# Altium project ISL6236A_DEMO_V1.PrjPcb
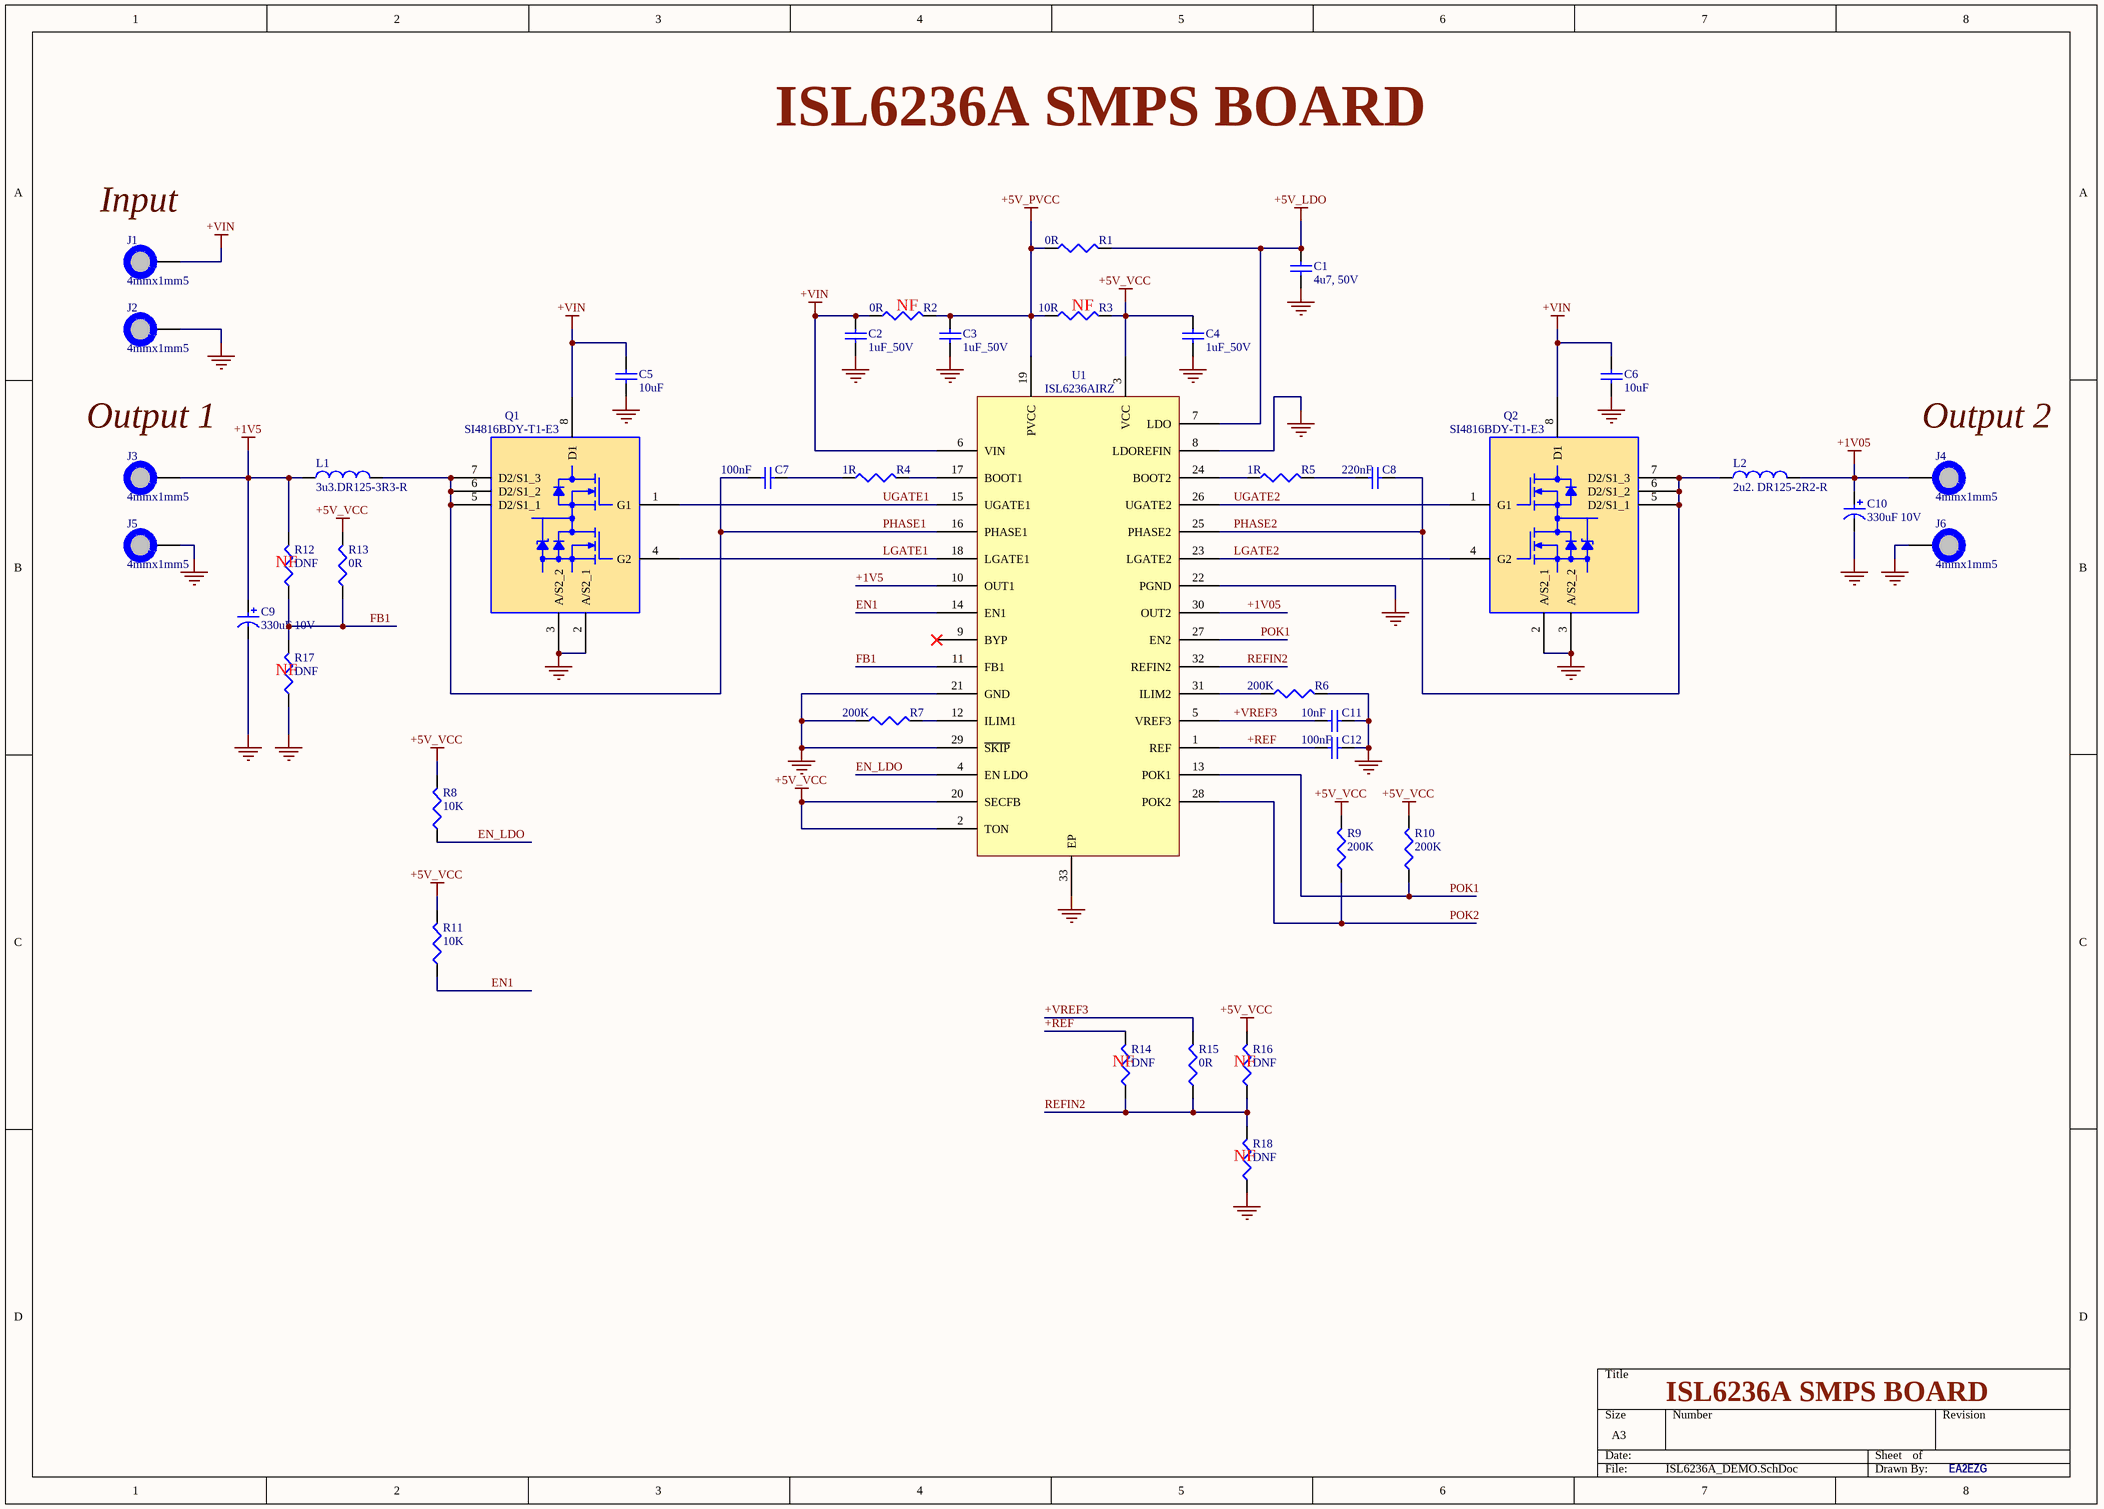
[diagram p0: ISL6236A_DEMO.SchDoc]
1 sheet, 41 parts. Net scope: global (net labels, ports and power ports of the same name join across sheets).
Board file: ISL6236_DEMO_PCB.PcbDoc

## Sheet ISL6236A_DEMO.SchDoc
size A3; SheetNumber: 1; SheetTotal: 1

### Parts
C1  4u7, 50V  [C1206]
C2  1uF_50V  [C0805]
C3  1uF_50V  [C0805]
C4  1uF_50V  [C0805]
C5  10uF  [C1210]
C6  10uF  [C1210]
C7  100nF  [C0805]
C8  220nF  [C0805]
C9  330uF 10V  [7343-43]
C10  330uF 10V  [7343-43]
C11  10nF  [C0805]
C12  100nF  [C0805]
J1  4mmx1mm5  [PAD_WITH_HOLE_4mmx1mm5]
J2  4mmx1mm5  [PAD_WITH_HOLE_4mmx1mm5]
J3  4mmx1mm5  [PAD_WITH_HOLE_4mmx1mm5]
J4  4mmx1mm5  [PAD_WITH_HOLE_4mmx1mm5]
J5  4mmx1mm5  [PAD_WITH_HOLE_4mmx1mm5]
J6  4mmx1mm5  [PAD_WITH_HOLE_4mmx1mm5]
L1  3u3.DR125-3R3-R  [DR125]
L2  2u2. DR125-2R2-R  [DR125]
Q1  SI4816BDY-T1-E3  [SO-8]
Q2  SI4816BDY-T1-E3  [SO-8]
R1  0R  [R0805]
R2  0R  [R0805]
R3  10R  [R0805]
R4  1R  [R0805]
R5  1R  [R0805]
R6  200K  [R0805]
R7  200K  [R0805]
R8  10K  [R0805]
R9  200K  [R0805]
R10  200K  [R0805]
R11  10K  [R0805]
R12  DNF  [R0805]
R13  0R  [R0805]
R14  DNF  [R0805]
R15  0R  [R0805]
R16  DNF  [R0805]
R17  DNF  [R0805]
R18  DNF  [R0805]
U1  ISL6236AIRZ  [L32.5X5B]

### Nets
+1V5: C9.1 J3.1 L1.1 R12.2 U1.10(OUT1)
+1V05: C10.1 J4.1 L2.2 U1.30(OUT2)
+5V_LDO: C1.2 R1.2 U1.7(LDO)
+5V_PVCC: C3.2 R1.1 R2.2 R3.1 U1.19(PVCC)
+5V_VCC: C4.2 R3.2 R8.2 R9.2 R10.2 R11.2 R13.2 R16.2 U1.2(TON) U1.3(VCC) U1.20(SECFB)
+VIN: C2.2 C5.2 C6.2 J1.1 Q1.8(D1) Q2.8(D1) R2.1 U1.6(VIN)
GND: C1.1 C2.1 C3.1 C4.1 C5.1 C6.1 C9.2 C10.2 C11.1 C12.2 J2.1 J5.1 J6.1 Q1.2(A/S2_1) Q1.3(A/S2_2) Q2.2(A/S2_1) Q2.3(A/S2_2) R6.2 R7.1 R17.1 R18.1 U1.8(LDOREFIN) U1.21(GND) U1.22(PGND) U1.29(~{SKIP}) U1.33(EP)
+REF: C12.1 R14.2 U1.1(REF)
+VREF3: C11.2 R15.2 U1.5(VREF3)
EN1: R11.1 U1.14(EN1)
EN_LDO: R8.1 U1.4(EN_LDO)
FB1: R12.1 R13.1 R17.2 U1.11(FB1)
LGATE1: Q1.4(G2) U1.18(LGATE1)
LGATE2: Q2.4(G2) U1.23(LGATE2)
PHASE1: C7.1 L1.2 Q1.5(D2/S1_1) Q1.6(D2/S1_2) Q1.7(D2/S1_3) U1.16(PHASE1)
PHASE2: C8.2 L2.1 Q2.5(D2/S1_1) Q2.6(D2/S1_2) Q2.7(D2/S1_3) U1.25(PHASE2)
POK1: R10.1 U1.13(POK1) U1.27(EN2)
POK2: R9.1 U1.28(POK2)
REFIN2: R14.1 R15.1 R16.1 R18.2 U1.32(REFIN2)
UGATE1: Q1.1(G1) U1.15(UGATE1)
UGATE2: Q2.1(G1) U1.26(UGATE2)
NetC7_2: C7.2 R4.1
NetC8_1: C8.1 R5.2
NetR4_2: R4.2 U1.17(BOOT1)
NetR5_1: R5.1 U1.24(BOOT2)
NetR6_1: R6.1 U1.31(ILIM2)
NetR7_2: R7.2 U1.12(ILIM1)

Not connected (* = marked no-connect by the designer): U1 9(BYP)*

### Notes on the sheet
- ISL6236A SMPS BOARD
- (near J1) Input
- (near R2) NF
- (near R3) NF
- (near J3) Output 1
- (near J4) Output 2
- (near R12) NF
- (near R17) NF
- (near R14) NF
- (near R16) NF
- (near R18) NF
- EA2EZG

### Library data of the parts
C1 = C3216X5R1H475K160AB: C Series 1206 4.7 uF 50 V ±10 % Tolerance X5R SMT Multilayer Ceramic Capacitor; Manufacturer: TDK; Supplier 1: Digi-Key; Manufacturer Part Number: C3216X5R1H475K160AB; RoHS: Yes; Category: Ceramic Capacitors; Stock 1: 67002; Pricing 1: 1=0,72, 10=0,53, 50=0,4242, 100=0,3636, 500=0,28784, 1000=0,2424 (USD); ComponentLink1URL: https://datasheet.ciiva.com/24216/c3216x5r1h475k160ab-265269-24216325.pdf?src-supplier=Mouser; ComponentLink1Description: https://datasheet.ciiva.com/24216/c3216x5r1h475k160ab-265269-24216325.pdf?src-supplier=Mouser; ComponentLink2URL: https://datasheet.ciiva.com/6286/tdkmlcccaprange-6286230.pdf?src-supplier=Digi-Key; ComponentLink2Description: https://datasheet.ciiva.com/6286/tdkmlcccaprange-6286230.pdf?src-supplier=Digi-Key; ComponentLink3URL: https://datasheet.ciiva.com/6286/tdkmlcccaprange-6286233.pdf?src-supplier=Digi-Key; ComponentLink3Description: https://datasheet.ciiva.com/6286/tdkmlcccaprange-6286233.pdf?src-supplier=Digi-Key; ComponentLink4URL: https://datasheet.ciiva.com/6286/tdkmlcccaprange-6286236.pdf?src-supplier=Digi-Key; ComponentLink4Description: https://datasheet.ciiva.com/6286/tdkmlcccaprange-6286236.pdf?src-supplier=Digi-Key; Supplier Part Number 1: 445-5994-1-ND
C2-C4 = C2012X7R1H105K125AB: C Series 0805 1 uF 50 V ±10% Tolerance X7R SMT Multilayer Ceramic Capacitor; Manufacturer: TDK; Supplier 1: Digi-Key; Manufacturer Part Number: C2012X7R1H105K125AB; RoHS: Yes; Category: Ceramic Capacitors; Stock 1: 331733; Pricing 1: 1=0,28, 10=0,189, 50=0,126, 100=0,1071, 500=0,07562, 1000=0,06618 (USD); ComponentLink1URL: https://datasheet.ciiva.com/6274/tdkmlcccaprange-6274886.pdf?src-supplier=Digi-Key; ComponentLink1Description: https://datasheet.ciiva.com/6274/tdkmlcccaprange-6274886.pdf?src-supplier=Digi-Key; ComponentLink2URL: https://datasheet.ciiva.com/6274/tdkmlcccaprange-6274888.pdf?src-supplier=Digi-Key; ComponentLink2Description: https://datasheet.ciiva.com/6274/tdkmlcccaprange-6274888.pdf?src-supplier=Digi-Key; ComponentLink3URL: https://datasheet.ciiva.com/6274/tdkmlcccaprange-6274890.pdf?src-supplier=Digi-Key; ComponentLink3Description: https://datasheet.ciiva.com/6274/tdkmlcccaprange-6274890.pdf?src-supplier=Digi-Key; ComponentLink4URL: https://datasheet.ciiva.com/24191/general-b11-24191449.pdf?src-supplier=Future+Electronics; ComponentLink4Description: https://datasheet.ciiva.com/24191/general-b11-24191449.pdf?src-supplier=Future+Electronics; ComponentLink5URL: https://datasheet.ciiva.com/28673/mlcc-commercial-general-en-28673565.pdf?src-supplier=Element14; ComponentLink5Description: https://datasheet.ciiva.com/28673/mlcc-commercial-general-en-28673565.pdf?src-supplier=Element14; ComponentLink6URL: https://datasheet.ciiva.com/22718/1796654-22718037.pdf?src-supplier=Element14; ComponentLink6Description: https://datasheet.ciiva.com/22718/1796654-22718037.pdf?src-supplier=Element14; ComponentLink7URL: https://datasheet.ciiva.com/23803/1796654-23803036.pdf?src-supplier=Newark; ComponentLink7Description: https://datasheet.ciiva.com/23803/1796654-23803036.pdf?src-supplier=Newark; Supplier Part Number 1: 445-7547-1-ND
C5 C6 = C1210C106K5PACTU: Multilayer Ceramic Capacitor, 10 uF, 50 V, ± 10%, X5R, 1210 [3225 Metric]; Manufacturer: KEMET; Supplier 1: Digi-Key; Manufacturer Part Number: C1210C106K5PACTU; RoHS: Yes; Category: Ceramic Capacitors; Stock 1: 93202; Pricing 1: 1=0,95, 10=0,722, 50=0,6, 100=0,5166, 500=0,39996 (USD); ComponentLink1URL: https://datasheet.ciiva.com/29540/kem-c1006-x5r-smd-29540231.pdf?src-supplier=Digi-Key; ComponentLink1Description: https://datasheet.ciiva.com/29540/kem-c1006-x5r-smd-29540231.pdf?src-supplier=Digi-Key; ComponentLink2URL: https://datasheet.ciiva.com/29540/kem-c1006-x5r-smd-29540232.pdf?src-supplier=Digi-Key; ComponentLink2Description: https://datasheet.ciiva.com/29540/kem-c1006-x5r-smd-29540232.pdf?src-supplier=Digi-Key; ComponentLink3URL: https://datasheet.ciiva.com/29540/kem-c1006-x5r-smd-29540233.pdf?src-supplier=Digi-Key; ComponentLink3Description: https://datasheet.ciiva.com/29540/kem-c1006-x5r-smd-29540233.pdf?src-supplier=Digi-Key; Supplier Part Number 1: 399-C1210C106K5PAC7800CT-ND
C7 C12 = C0805C104K5REC7210: Cap Cer 0805 0.1UF 50V X7R 10%; Manufacturer: KEMET; Supplier 1: Digi-Key; Manufacturer Part Number: C0805C104K5REC7210; RoHS: Yes; Category: Ceramic Capacitors; Stock 1: 14120; Pricing 1: 1=0,26, 10=0,176, 50=0,1054, 100=0,089, 500=0,06092, 1000=0,05389, 2500=0,05155, 5000=0,04686 (USD); RoHS Compliant: Yes; ComponentLink1URL: https://api.kemet.com/component-edge/download/datasheet/C0805C104K5REC7210.pdf?src-supplier=Digi-Key; ComponentLink1Description: https://api.kemet.com/component-edge/download/datasheet/C0805C104K5REC7210.pdf?src-supplier=Digi-Key; Supplier Part Number 1: 399-C0805C104K5REC7210CT-ND
C8 = C0805F224K5RACTU: Cap Ceramic 0.22uF 50V X7R 10% SMD 2.0 x 1.2 mm OMD-CAP 125 C Plastic T/R; Manufacturer: KEMET; Supplier 1: Digi-Key; Manufacturer Part Number: C0805F224K5RACTU; RoHS: Yes; Category: Ceramic Capacitors; Stock 1: 27532; Pricing 1: 1=0,45, 10=0,319, 50=0,241, 100=0,21, 500=0,15554, 1000=0,13221 (USD); ComponentLink1URL: https://datasheet.ciiva.com/147/docfinderpartnumber-c0805f224k5ractu-147508.pdf?src-supplier=Digi-Key; ComponentLink1Description: https://datasheet.ciiva.com/147/docfinderpartnumber-c0805f224k5ractu-147508.pdf?src-supplier=Digi-Key; ComponentLink2URL: https://datasheet.ciiva.com/5969/kem-c1002-x7r-smd-5969831.pdf?src-supplier=Farnell; ComponentLink2Description: https://datasheet.ciiva.com/5969/kem-c1002-x7r-smd-5969831.pdf?src-supplier=Farnell; ComponentLink3URL: https://datasheet.ciiva.com/7842/kem-c1002-x7r-smd-7842633.pdf?src-supplier=Element14; ComponentLink3Description: https://datasheet.ciiva.com/7842/kem-c1002-x7r-smd-7842633.pdf?src-supplier=Element14; Supplier Part Number 1: 399-C0805F224K5RAC7800CT-ND
C9 C10 = T530X337M010ATE004: Cap Tant Solid 330uF 10V X CASE 20% (7.3 X 4.3 X 4mm) SMD 7343-43 0.004 Ohm 125 C T/R; Manufacturer: KEMET; Supplier 1: Digi-Key; Manufacturer Part Number: T530X337M010ATE004; RoHS: Yes; Category: Polymer Capacitors; Stock 1: 1921; Pricing 1: 1=7,14, 10=6,35, 50=5,5562, 100=5,0799 (USD); ComponentLink1URL: https://datasheet.ciiva.com/11794/0900766b80deaa91-11794477.pdf?src-supplier=Rs; ComponentLink1Description: https://datasheet.ciiva.com/11794/0900766b80deaa91-11794477.pdf?src-supplier=Rs; ComponentLink2URL: https://datasheet.ciiva.com/14593/70096008-14593753.pdf?src-supplier=Allied+Electronics; ComponentLink2Description: https://datasheet.ciiva.com/14593/70096008-14593753.pdf?src-supplier=Allied+Electronics; Supplier Part Number 1: 399-10378-1-ND
C11 = C0805F103K5RACTU: 0805 C 10nF Ceramic Multilayer Capacitor; 50 VDC; +125degC; X7R Dielec; +/-10%; Manufacturer: KEMET; Supplier 1: Digi-Key; Manufacturer Part Number: C0805F103K5RACTU; RoHS: Yes; Category: Ceramic Capacitors; Stock 1: 11337; Pricing 1: 1=0,35, 10=0,237, 50=0,158, 100=0,1343, 500=0,09478, 1000=0,08293 (USD); ComponentLink1URL: https://datasheet.ciiva.com/146/docfinderpartnumber-c0805f103k5ractu-146278.pdf?src-supplier=Digi-Key; ComponentLink1Description: https://datasheet.ciiva.com/146/docfinderpartnumber-c0805f103k5ractu-146278.pdf?src-supplier=Digi-Key; ComponentLink2URL: https://datasheet.ciiva.com/7842/48829-7842407.pdf?src-supplier=Element14; ComponentLink2Description: https://datasheet.ciiva.com/7842/48829-7842407.pdf?src-supplier=Element14; ComponentLink3URL: https://datasheet.ciiva.com/7842/48829-7842408.pdf?src-supplier=Element14; ComponentLink3Description: https://datasheet.ciiva.com/7842/48829-7842408.pdf?src-supplier=Element14; Supplier Part Number 1: 399-C0805F103K5RAC7800CT-ND
J1-J6 = PAD_WITH_HOLE_4mmx1mm5: Pad with a hole 4mmx1mm5
L1 = DR125-3R3-R: Inductor Power Shielded Drum Core 3.3uH 20% 100KHz Ferrite 9.26A 6.3mOhm DCR T/R; Manufacturer: Eaton Cooper; Supplier 1: Digi-Key; Manufacturer Part Number: DR125-3R3-R; RoHS: Yes; Category: Fixed Inductors; Stock 1: 28814; Pricing 1: 1=1,24, 10=1,149, 25=1,0604, 50=0,8836, 100=0,8307, 250=0,74228 (USD); ComponentLink1URL: https://datasheet.ciiva.com/26858/getdatasheetpartid-251124-26858392.pdf?src-supplier=Verical; ComponentLink1Description: https://datasheet.ciiva.com/26858/getdatasheetpartid-251124-26858392.pdf?src-supplier=Verical; ComponentLink2URL: https://datasheet.ciiva.com/16295/bus-elx-ds-4315-dr-series-16295562.pdf?src-supplier=Future+Electronics; ComponentLink2Description: https://datasheet.ciiva.com/16295/bus-elx-ds-4315-dr-series-16295562.pdf?src-supplier=Future+Electronics; ComponentLink3URL: https://datasheet.ciiva.com/30081/4a32919a-7470-4ae0-be45-b59e3a1351ef-30081146.pdf?src-supplier=Onlinecomponents.com; ComponentLink3Description: https://datasheet.ciiva.com/30081/4a32919a-7470-4ae0-be45-b59e3a1351ef-30081146.pdf?src-supplier=Onlinecomponents.com; ComponentLink4URL: https://datasheet.ciiva.com/5707/87246-5707962.pdf?src-supplier=Farnell; ComponentLink4Description: https://datasheet.ciiva.com/5707/87246-5707962.pdf?src-supplier=Farnell; Supplier Part Number 1: 513-1529-1-ND
L2 = DR125-2R2-R: Ind Power Shielded Wirewound 2.2uH 20% 100KHz Ferrite 10.9A T/R; Manufacturer: Eaton Cooper; Supplier 1: Digi-Key; Manufacturer Part Number: DR125-2R2-R; RoHS: Yes; Category: Fixed Inductors; Stock 1: 2367; Pricing 1: 1=1,24, 10=1,149, 25=1,0604, 50=0,8838, 100=0,8307, 250=0,74236 (USD); ComponentLink1URL: https://datasheet.ciiva.com/14667/0900766b8116a153-14667792.pdf?src-supplier=Rs; ComponentLink1Description: https://datasheet.ciiva.com/14667/0900766b8116a153-14667792.pdf?src-supplier=Rs; ComponentLink2URL: https://datasheet.ciiva.com/26926/getdatasheetpartid-571249-26926912.pdf?src-supplier=Verical; ComponentLink2Description: https://datasheet.ciiva.com/26926/getdatasheetpartid-571249-26926912.pdf?src-supplier=Verical; ComponentLink3URL: https://datasheet.ciiva.com/8004/87246-8004874.pdf?src-supplier=Element14; ComponentLink3Description: https://datasheet.ciiva.com/8004/87246-8004874.pdf?src-supplier=Element14; Supplier Part Number 1: 513-1662-1-ND
Q1 Q2 = SI4816BDY-T1-E3: Trans Mosfet N-ch 30V 5.8A/8.2A 8-PIN SOIC N T/r; Manufacturer: Vishay Siliconix; Supplier 1: Digi-Key; Manufacturer Part Number: SI4816BDY-T1-E3; RoHS: Yes; Category: MOSFETs; Pricing 1: 1=1,64, 10=1,475, 100=1,1853, 500=0,97388, 1000=0,80692 (USD); ComponentLink1URL: https://datasheet.ciiva.com/15137/getdatasheetpartid-99188-15137841.pdf?src-supplier=Verical; ComponentLink1Description: https://datasheet.ciiva.com/15137/getdatasheetpartid-99188-15137841.pdf?src-supplier=Verical; ComponentLink2URL: https://datasheet.ciiva.com/7710/si4816bd-7710449.pdf?src-supplier=Element14; ComponentLink2Description: https://datasheet.ciiva.com/7710/si4816bd-7710449.pdf?src-supplier=Element14; ComponentLink3URL: https://datasheet.ciiva.com/928/si4816bd-928458.pdf?src-supplier=Digi-Key; ComponentLink3Description: https://datasheet.ciiva.com/928/si4816bd-928458.pdf?src-supplier=Digi-Key; ComponentLink4URL: https://datasheet.ciiva.com/928/si4816bd-928459.pdf?src-supplier=Digi-Key; ComponentLink4Description: https://datasheet.ciiva.com/928/si4816bd-928459.pdf?src-supplier=Digi-Key; ComponentLink5URL: https://datasheet.ciiva.com/928/si4816bd-928460.pdf?src-supplier=Digi-Key; ComponentLink5Description: https://datasheet.ciiva.com/928/si4816bd-928460.pdf?src-supplier=Digi-Key; ComponentLink6URL: https://datasheet.ciiva.com/11161/si4816bd-11161496.pdf?src-supplier=Avnet; ComponentLink6Description: https://datasheet.ciiva.com/11161/si4816bd-11161496.pdf?src-supplier=Avnet; ComponentLink7URL: https://datasheet.ciiva.com/16486/si4816bd-16486349.pdf?src-supplier=Future+Electronics; ComponentLink7Description: https://datasheet.ciiva.com/16486/si4816bd-16486349.pdf?src-supplier=Future+Electronics; ComponentLink8URL: https://datasheet.ciiva.com/18448/70026226-18448822.pdf?src-supplier=Allied+Electronics; ComponentLink8Description: https://datasheet.ciiva.com/18448/70026226-18448822.pdf?src-supplier=Allied+Electronics; Supplier Part Number 1: SI4816BDY-T1-E3DKR-ND
R1 R2 R13 R15 = RK73Z2ARTTD: Res Thick Film 0805 0 Ohm Sulfur Resistant Pad SMD Automotive T/R; Manufacturer: KOA Speer; Supplier 1: Digi-Key; Manufacturer Part Number: RK73Z2ARTTD; Category: Chip SMD Resistors; Stock 1: 238043; Pricing 1: 1=0,16, 10=0,133, 50=0,0702, 100=0,0521, 500=0,03152, 1000=0,02182 (USD); Case/Package: 0805; Min Operating Temperature: -55°C; Max Operating Temperature: 155°C; Resistance: 0R; Construction: Rectangular; Length: 2mm; Depth: 1.25mm; Military Standard: Not; RoHS Compliant: Yes; ComponentLink1URL: https://datasheet.octopart.com/RK73Z2ARTTD-KOA-Speer-datasheet-149653817.pdf?src-supplier=Farnell; ComponentLink1Description: https://datasheet.octopart.com/RK73Z2ARTTD-KOA-Speer-datasheet-149653817.pdf?src-supplier=Farnell; ComponentLink2URL: https://datasheet.octopart.com/RK73Z2ARTTD-KOA-Speer-datasheet-149653814.pdf?src-supplier=Farnell; ComponentLink2Description: https://datasheet.octopart.com/RK73Z2ARTTD-KOA-Speer-datasheet-149653814.pdf?src-supplier=Farnell; Supplier Part Number 1: 2019-RK73Z2ARTTDCT-ND
R3 = AC0805FR-0710RL: Res Thick Film 0805 10 Ohm 1% 0.125W(1/8W) ±200ppm/C Pad SMD Automotive T/R; Manufacturer: Yageo; Supplier 1: Digi-Key; Manufacturer Part Number: AC0805FR-0710RL; RoHS: Yes; Category: Chip SMD Resistors; Stock 1: 256849; Pricing 1: 1=0,1, 10=0,049, 50=0,032, 100=0,0272, 500=0,01914, 1000=0,01668 (USD); ComponentLink1URL: http://www.mouser.com/ds/2/447/yageodocoutput-1111992.pdf?src-supplier=Mouser; ComponentLink1Description: http://www.mouser.com/ds/2/447/yageodocoutput-1111992.pdf?src-supplier=Mouser; ComponentLink2URL: http://www.yageo.com/NewPortal/yageodocoutput?fileName=/pdf/R-Chip/PYu-AC_51_RoHS_L_6.pdf&src-supplier=Digi-Key; ComponentLink2Description: http://www.yageo.com/NewPortal/yageodocoutput?fileName=/pdf/R-Chip/PYu-AC_51_RoHS_L_6.pdf&src-supplier=Digi-Key; ComponentLink3URL: https://www.yageo.com/upload/media/product/productsearch/datasheet/rchip/PYu-AC_51_RoHS_L_7.pdf?src-supplier=Digi-Key; ComponentLink3Description: https://www.yageo.com/upload/media/product/productsearch/datasheet/rchip/PYu-AC_51_RoHS_L_7.pdf?src-supplier=Digi-Key; Supplier Part Number 1: YAG3690CT-ND
R4 R5 = AC0805FR-071RL: Res Thick Film 0805 1 Ohm 1% 0.125W(1/8W) ±200ppm/C Pad SMD Automotive T/R; Manufacturer: Yageo; Supplier 1: Digi-Key; Manufacturer Part Number: AC0805FR-071RL; RoHS: Yes; Category: Chip SMD Resistors; Stock 1: 82542; Pricing 1: 1=0,1, 10=0,049, 50=0,032, 100=0,0272, 500=0,01914, 1000=0,01668 (USD); ComponentLink1URL: https://datasheet.ciiva.com/12576/pyu-ac-51-rohs-l-2-12576553.pdf?src-supplier=Mouser; ComponentLink1Description: https://datasheet.ciiva.com/12576/pyu-ac-51-rohs-l-2-12576553.pdf?src-supplier=Mouser; Supplier Part Number 1: YAG3705CT-ND
R6 R7 R9 R10 = AC0805FR-07200KL: Res Thick Film 0805 200K Ohm 1% 0.125W(1/8W) ±100ppm/C Pad SMD Automotive T/R; Manufacturer: Yageo; Supplier 1: Digi-Key; Manufacturer Part Number: AC0805FR-07200KL; RoHS: Yes; Category: Chip SMD Resistors; Stock 1: 11002; Pricing 1: 1=0,1, 10=0,029, 50=0,0188, 100=0,0158, 500=0,01096, 1000=0,00948 (USD); ComponentLink1URL: http://www.mouser.com/ds/2/447/yageodocoutput-1111992.pdf?src-supplier=Mouser; ComponentLink1Description: http://www.mouser.com/ds/2/447/yageodocoutput-1111992.pdf?src-supplier=Mouser; ComponentLink2URL: https://datasheet.octopart.com/AC0805FR-07200KL-Yageo-datasheet-151884373.pdf?src-supplier=Future+Electronics; ComponentLink2Description: https://datasheet.octopart.com/AC0805FR-07200KL-Yageo-datasheet-151884373.pdf?src-supplier=Future+Electronics; ComponentLink3URL: http://www.yageo.com/NewPortal/yageodocoutput?fileName=/pdf/R-Chip/PYu-AC_51_RoHS_L_6.pdf&src-supplier=Digi-Key; ComponentLink3Description: http://www.yageo.com/NewPortal/yageodocoutput?fileName=/pdf/R-Chip/PYu-AC_51_RoHS_L_6.pdf&src-supplier=Digi-Key; ComponentLink4URL: http://www.yageo.com/documents/recent/PYu-AC_51_RoHS_L_2.pdf?src-supplier=Future+Electronics; ComponentLink4Description: http://www.yageo.com/documents/recent/PYu-AC_51_RoHS_L_2.pdf?src-supplier=Future+Electronics; Supplier Part Number 1: YAG3706CT-ND
R8 R11 = RP0805FRE0710KL: Res, 10K, 1%, 0.125W, Thin Film, 0805 Rohs Compliant: Yes |Yageo RP0805FRE0710KL; Manufacturer: Yageo; Supplier 1: Digi-Key; Manufacturer Part Number: RP0805FRE0710KL; RoHS: No; Category: Chip SMD Resistors; Stock 1: 4789; Pricing 1: 1=0,34, 10=0,289, 50=0,1524, 100=0,1129, 500=0,06828, 1000=0,04727 (USD); Supplier Part Number 1: 13-RP0805FRE0710KLCT-ND
R12 R14 R16-R18 = RES
U1 = ISL6236AIRZ: Soft Sw PWM Cntrlr 2-OUT Power Supply Controller 200KHz/300KHz/400KHz/500KHz 32-Pin QFN EP; Manufacturer: Renesas; Supplier 1: Digi-Key; Manufacturer Part Number: ISL6236AIRZ; RoHS: Yes; Stock 1: 663; Pricing 1: 1=6,69, 10=6,039, 25=5,7584, 100=5, 250=4,77528, 500=4,4255 (USD); ComponentLink1URL: https://datasheet.octopart.com/ISL6236AIRZ-Renesas-datasheet-138160199.pdf?src-supplier=Future+Electronics; ComponentLink1Description: https://datasheet.octopart.com/ISL6236AIRZ-Renesas-datasheet-138160199.pdf?src-supplier=Future+Electronics; ComponentLink2URL: http://www.intersil.com/content/dam/Intersil/documents/isl6/isl6236a.pdf?src-supplier=Digi-Key; ComponentLink2Description: http://www.intersil.com/content/dam/Intersil/documents/isl6/isl6236a.pdf?src-supplier=Digi-Key; Supplier Part Number 1: ISL6236AIRZ-ND